# EAGLE schematic telfer-control (EAGLE 7.4.0)
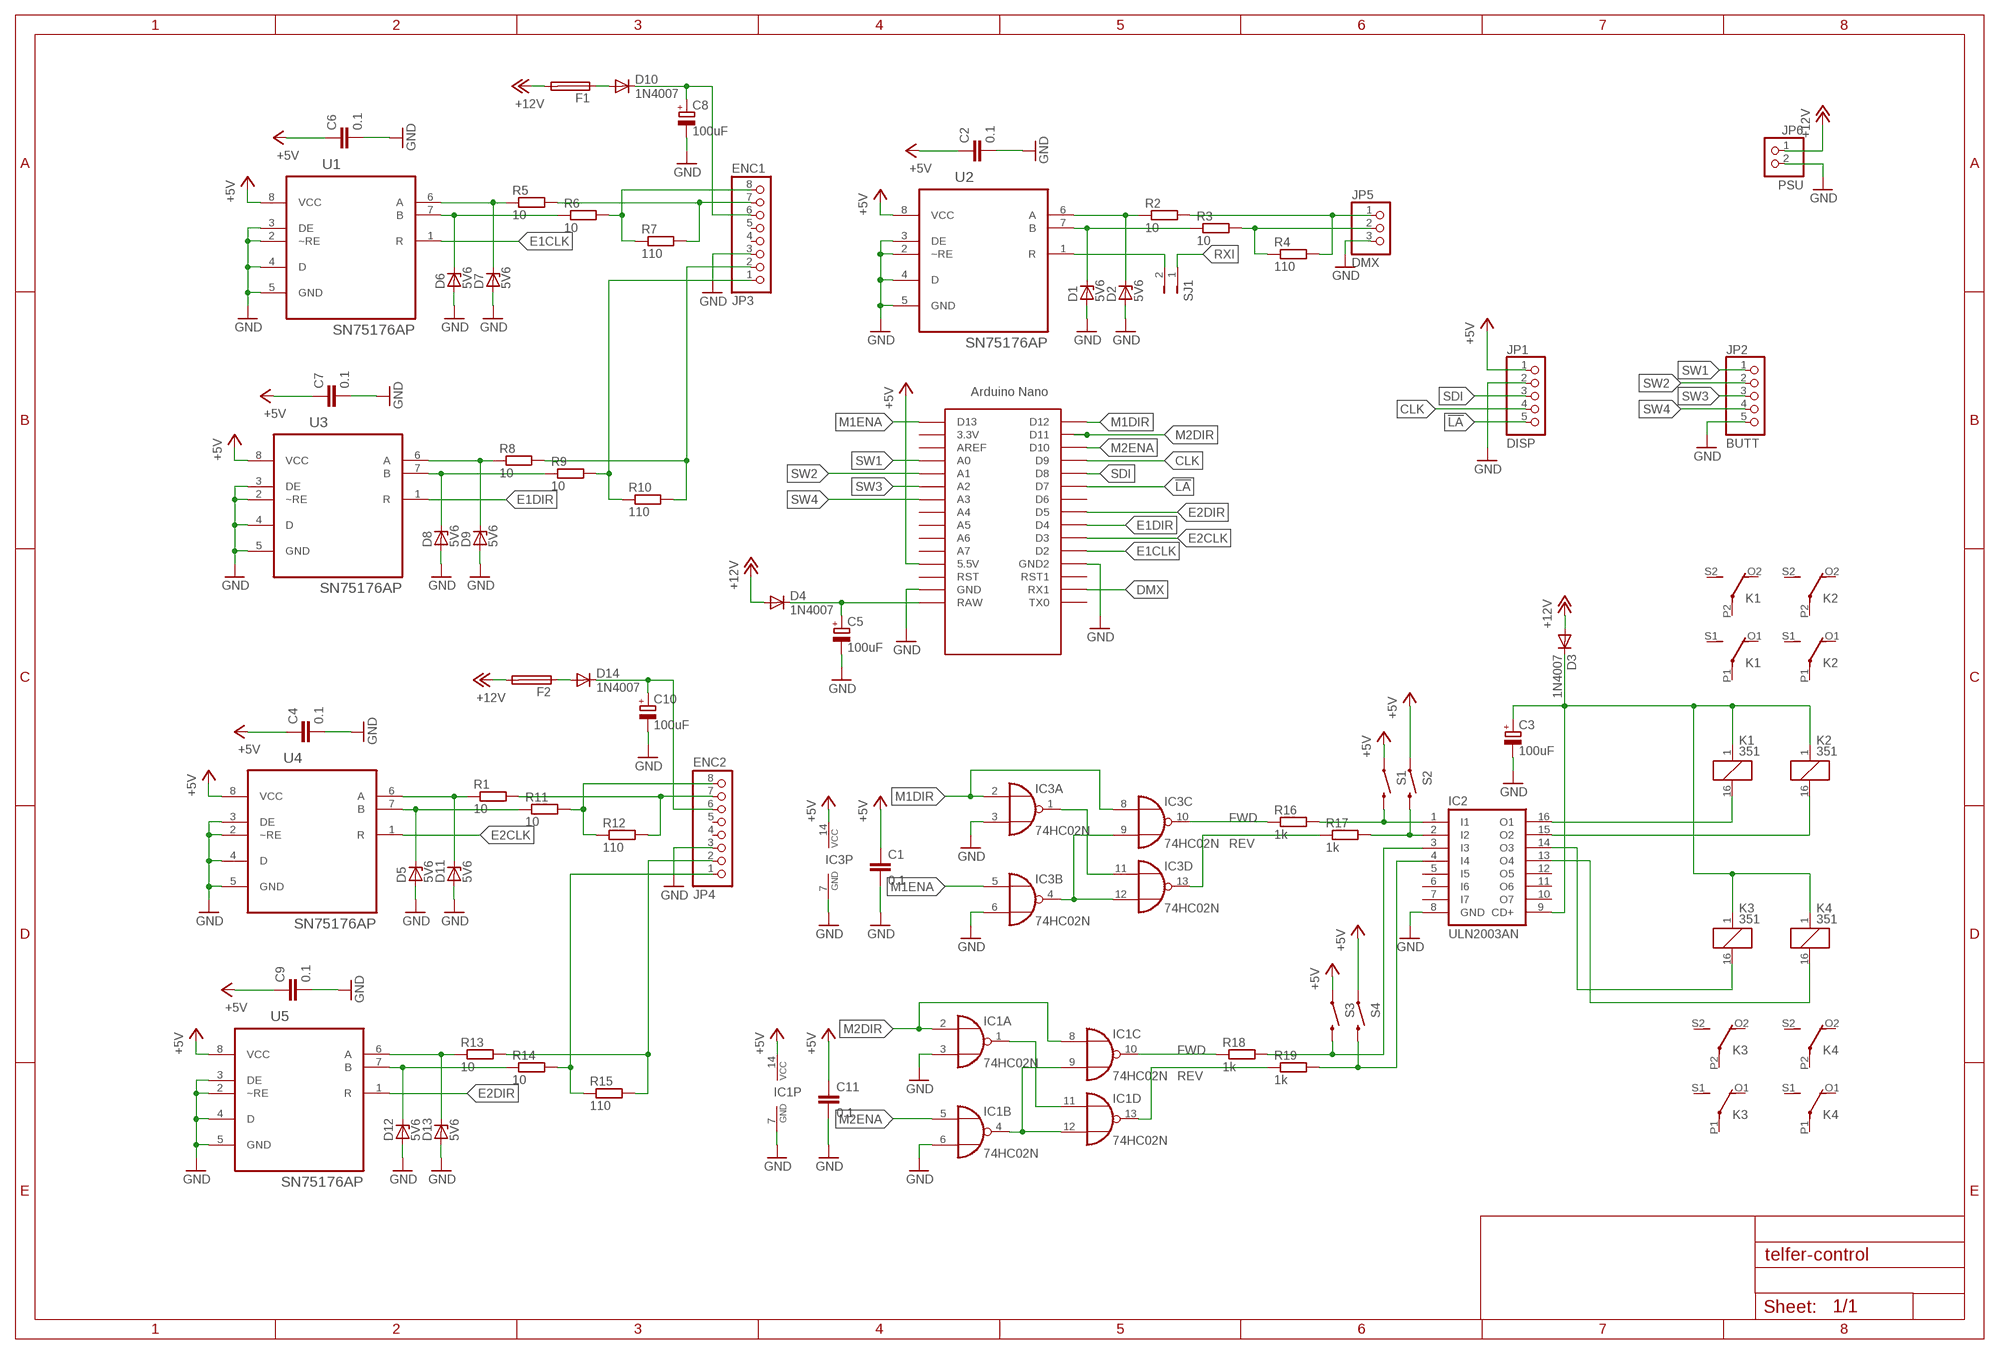
[diagram p0: schematic, sheet 1]

## Parts
C1  0.1  C-EU050-025X075  [C050-025X075]
C2  0.1  C-EU050-025X075  [C050-025X075]
C3  100uF  CPOL-EUE2.5-7  [E2,5-7]
C4  0.1  C-EU050-025X075  [C050-025X075]
C5  100uF  CPOL-EUE2.5-7  [E2,5-7]
C6  0.1  C-EU050-025X075  [C050-025X075]
C7  0.1  C-EU050-025X075  [C050-025X075]
C8  100uF  CPOL-EUE2.5-7  [E2,5-7]
C9  0.1  C-EU050-025X075  [C050-025X075]
C10  100uF  CPOL-EUE2.5-7  [E2,5-7]
C11  0.1  C-EU050-025X075  [C050-025X075]
D1  5V6  ZENER-DIODEDO34-7  [DO34Z7]
D2  5V6  ZENER-DIODEDO34-7  [DO34Z7]
D3  1N4007  DIODE-DO41-10  [DO41-10]
D4  1N4007  DIODE-DO41-10  [DO41-10]
D5  5V6  ZENER-DIODEDO34-7  [DO34Z7]
D6  5V6  ZENER-DIODEDO34-7  [DO34Z7]
D7  5V6  ZENER-DIODEDO34-7  [DO34Z7]
D8  5V6  ZENER-DIODEDO34-7  [DO34Z7]
D9  5V6  ZENER-DIODEDO34-7  [DO34Z7]
D10  1N4007  DIODE-DO41-10  [DO41-10]
D11  5V6  ZENER-DIODEDO34-7  [DO34Z7]
D12  5V6  ZENER-DIODEDO34-7  [DO34Z7]
D13  5V6  ZENER-DIODEDO34-7  [DO34Z7]
D14  1N4007  DIODE-DO41-10  [DO41-10]
F1  PICOFUSE  [PICOFUSE]
F2  PICOFUSE  [PICOFUSE]
IC1  74HC02N  [DIL14]
IC2  ULN2003AN  [DIL16]
IC3  74HC02N  [DIL14]
JP1  DISP  PINHD-1X5  [1X05]
JP2  BUTT  PINHD-1X5  [1X05]
JP3  ENC1  PINHD-1X8  [1X08]
JP4  ENC2  PINHD-1X8  [1X08]
JP5  DMX  PINHD-1X3  [1X03]
JP6  PSU  PINHD-1X2  [1X02]
K1  351  [351]
K2  351  [351]
K3  351  [351]
K4  351  [351]
R1  10  R-EU_0204/7  [0204/7]
R2  10  R-EU_0204/7  [0204/7]
R3  10  R-EU_0204/7  [0204/7]
R4  110  R-EU_0204/7  [0204/7]
R5  10  R-EU_0204/7  [0204/7]
R6  10  R-EU_0204/7  [0204/7]
R7  110  R-EU_0204/7  [0204/7]
R8  10  R-EU_0204/7  [0204/7]
R9  10  R-EU_0204/7  [0204/7]
R10  110  R-EU_0204/7  [0204/7]
R11  10  R-EU_0204/7  [0204/7]
R12  110  R-EU_0204/7  [0204/7]
R13  10  R-EU_0204/7  [0204/7]
R14  10  R-EU_0204/7  [0204/7]
R15  110  R-EU_0204/7  [0204/7]
R16  1k  R-EU_0204/7  [0204/7]
R17  1k  R-EU_0204/7  [0204/7]
R18  1k  R-EU_0204/7  [0204/7]
R19  1k  R-EU_0204/7  [0204/7]
S1  SWITCH-MOMENTARY-2PTH  [TACTILE-PTH]
S2  SWITCH-MOMENTARY-2PTH  [TACTILE-PTH]
S3  SWITCH-MOMENTARY-2PTH  [TACTILE-PTH]
S4  SWITCH-MOMENTARY-2PTH  [TACTILE-PTH]
SJ1  JUMPER-PTH-2-NO  [PTH-JUMPER-2-NO_NO_SILK]
U1  SN75176AP  [DIP254P762X508-8]
U2  SN75176AP  [DIP254P762X508-8]
U3  SN75176AP  [DIP254P762X508-8]
U4  SN75176AP  [DIP254P762X508-8]
U5  SN75176AP  [DIP254P762X508-8]
U$1  NANO  [NANO]

## Nets
!LA: JP1.5 U$1.D7
+5V: C1.1 C2.1 C4.1 C6.1 C7.1 C9.1 C11.1 IC1.14(P:VCC) IC3.14(P:VCC) JP1.1 S1.1 S2.1 S3.1 S4.1 U1.8(VCC) U2.8(VCC) U3.8(VCC) U4.8(VCC) U5.8(VCC) U$1.5V(5.5V)
+12V: D3.A D4.A F1.2 F2.2 JP6.1
CLK: JP1.4 U$1.D9
DMX: U$1.RX1
E1CLK: U1.1(R) U$1.D2
E1DIR: U3.1(R) U$1.D4
E2CLK: U4.1(R) U$1.D3
E2DIR: U5.1(R) U$1.D5
FWD: IC1.10(C:O) IC3.10(C:O) R16.1 R18.1
GND: C1.2 C2.2 C3.- C4.2 C5.- C6.2 C7.2 C8.- C9.2 C10.- C11.2 D1.A D2.A D5.A D6.A D7.A D8.A D9.A D11.A D12.A D13.A IC1.3(A:I1) IC1.6(B:I1) IC1.7(P:GND) IC2.8(GND) IC3.3(A:I1) IC3.6(B:I1) IC3.7(P:GND) JP1.2 JP2.5 JP3.3 JP4.3 JP5.3 JP6.2 U1.2(~RE) U1.3(DE) U1.4(D) U1.5(GND) U2.2(~RE) U2.3(DE) U2.4(D) U2.5(GND) U3.2(~RE) U3.3(DE) U3.4(D) U3.5(GND) U4.2(~RE) U4.3(DE) U4.4(D) U4.5(GND) U5.2(~RE) U5.3(DE) U5.4(D) U5.5(GND) U$1.GND U$1.GND1(GND2)
M1DIR: IC3.2(A:I0) IC3.8(C:I0) U$1.D12
M1ENA: IC3.5(B:I0) U$1.D13
M2DIR: IC1.2(A:I0) IC1.8(C:I0) U$1.D11
M2ENA: IC1.5(B:I0) U$1.D10
N$1: IC2.16(O1) K1.16
N$2: IC2.15(O2) K2.16
N$3: D6.C R6.1 U1.7(B)
N$4: IC3.4(B:O) IC3.9(C:I1) IC3.12(D:I1)
N$5: IC3.1(A:O) IC3.11(D:I0)
N$6: D1.C R3.1 U2.7(B)
N$7: D2.C R2.1 U2.6(A)
N$8: JP5.1 R2.2 R4.2
N$9: JP5.2 R3.2 R4.1
N$10: SJ1.2 U2.1(R)
N$11: C5.+ D4.C U$1.RAW
N$12: D7.C R5.1 U1.6(A)
N$13: IC1.4(B:O) IC1.9(C:I1) IC1.12(D:I1)
N$14: D8.C R9.1 U3.7(B)
N$15: JP3.7 R5.2 R7.2
N$16: JP3.8 R6.2 R7.1
N$17: D9.C R8.1 U3.6(A)
N$18: JP3.2 R8.2 R10.2
N$19: JP3.1 R9.2 R10.1
N$20: D10.A F1.1
N$21: D5.C R11.1 U4.7(B)
N$22: C8.+ D10.C JP3.6
N$23: D11.C R1.1 U4.6(A)
N$24: JP4.7 R1.2 R12.2
N$25: JP4.8 R11.2 R12.1
N$26: D12.C R14.1 U5.7(B)
N$27: D13.C R13.1 U5.6(A)
N$28: JP4.2 R13.2 R15.2
N$29: JP4.1 R14.2 R15.1
N$30: C10.+ D14.C JP4.6
N$31: D14.A F2.1
N$32: IC2.1(I1) R16.2 S1.3
N$33: IC2.2(I2) R17.2 S2.3
N$34: IC2.14(O3) K3.16
N$35: IC2.13(O4) K4.16
N$36: C3.+ D3.C IC2.9(CD+) K1.1 K2.1 K3.1 K4.1
N$37: IC1.1(A:O) IC1.11(D:I0)
N$38: IC2.3(I3) R18.2 S3.3
N$39: IC2.4(I4) R19.2 S4.3
REV: IC1.13(D:O) IC3.13(D:O) R17.1 R19.1
RXI: SJ1.1
SDI: JP1.3 U$1.D8
SW1: JP2.1 U$1.A0
SW2: JP2.2 U$1.A1
SW3: JP2.3 U$1.A2
SW4: JP2.4 U$1.A3
Unconnected: IC2.5(I5) IC2.6(I6) IC2.7(I7) IC2.10(O7) IC2.11(O6) IC2.12(O5) JP3.4 JP3.5 JP4.4 JP4.5 K1.O1(2:O) K1.O2(3:O) K1.P1(2:P) K1.P2(3:P) K1.S1(2:S) K1.S2(3:S) K2.O1(2:O) K2.O2(3:O) K2.P1(2:P) K2.P2(3:P) K2.S1(2:S) K2.S2(3:S) K3.O1(2:O) K3.O2(3:O) K3.P1(2:P) K3.P2(3:P) K3.S1(2:S) K3.S2(3:S) K4.O1(2:O) K4.O2(3:O) K4.P1(2:P) K4.P2(3:P) K4.S1(2:S) K4.S2(3:S) U$1.3.3V U$1.A4 U$1.A5 U$1.A6 U$1.A7 U$1.AREF U$1.D6 U$1.ICSP1 U$1.ICSP2 U$1.ICSP3 U$1.ICSP4 U$1.ICSP5 U$1.ICSP6 U$1.RST U$1.RST1 U$1.TX0

## Library data of the parts
C1 C2 C4 C6 C7 C9 C11 = rcl:C-EU: CAPACITOR, European symbol
C3 C5 C8 C10 = rcl:CPOL-EU: POLARIZED CAPACITOR, European symbol
D1 D2 D5-D9 D11-D13 = diode:ZENER-DIODE: Z-Diode
D3 D4 D10 D14 = diode:DIODE-: DIODE
F1 F2 = fuse:PICOFUSE: PICOFUSE 19275, Wickmann; OC_FARNELL: unknown; OC_NEWARK: unknown
IC1 IC3 = 74xx-eu:74*02: Quad 2-input NOR gate
IC2 = uln-udn:ULN2003A: DRIVER ARRAY
JP1 JP2 = pinhead:PINHD-1X5: PIN HEADER
JP3 JP4 = pinhead:PINHD-1X8: PIN HEADER
JP5 = pinhead:PINHD-1X3: PIN HEADER
JP6 = pinhead:PINHD-1X2: PIN HEADER
K1-K4 = relay:351: RELAY 2 x switch, Omron; OC_FARNELL: unknown; OC_NEWARK: unknown
R1-R19 = rcl:R-EU_: RESISTOR, European symbol
S1-S4 = SparkFun-Electromechanical:SWITCH-MOMENTARY-2: Various NO switches- pushbuttons, reed, etc; PROD_ID: SWCH-08441
SJ1 = SparkFun-Passives:JUMPER-PTH-2-NO
U1-U5 = Texas Instruments_By_element14_Batch_1:SN75176AP: DIFFERENTIAL BUS TRANSCEIVERS; MPN: SN75176AP; OC_FARNELL: 1103022; OC_NEWARK: 08F8125; PACKAGE: PDIP; SUPPLIER: Texas Instruments
U$1 = Arduino-clone:NANO: Arduino Nano